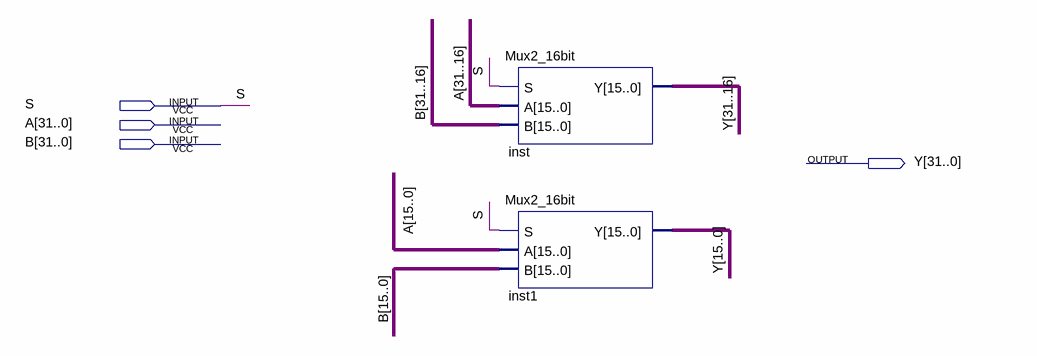
[diagram p0: schematic sheet]
// Quartus schematic Mux2_32bit.bdf as structural Verilog: 2 symbols, 4 pins
module Mux2_32bit (
  input  S,
  input  [31:0] A,
  input  [31:0] B,
  output [31:0] Y
);

  Mux2_16bit inst (.S(S), .A(A[31:16]), .B(B[31:16]), .Y(Y[31:16]));
  Mux2_16bit inst1 (.S(S), .A(A[15:0]), .B(B[15:0]), .Y(Y[15:0]));
endmodule
